# Altium schematic sheet Enable_Pulse_fire.SchDoc
size A3
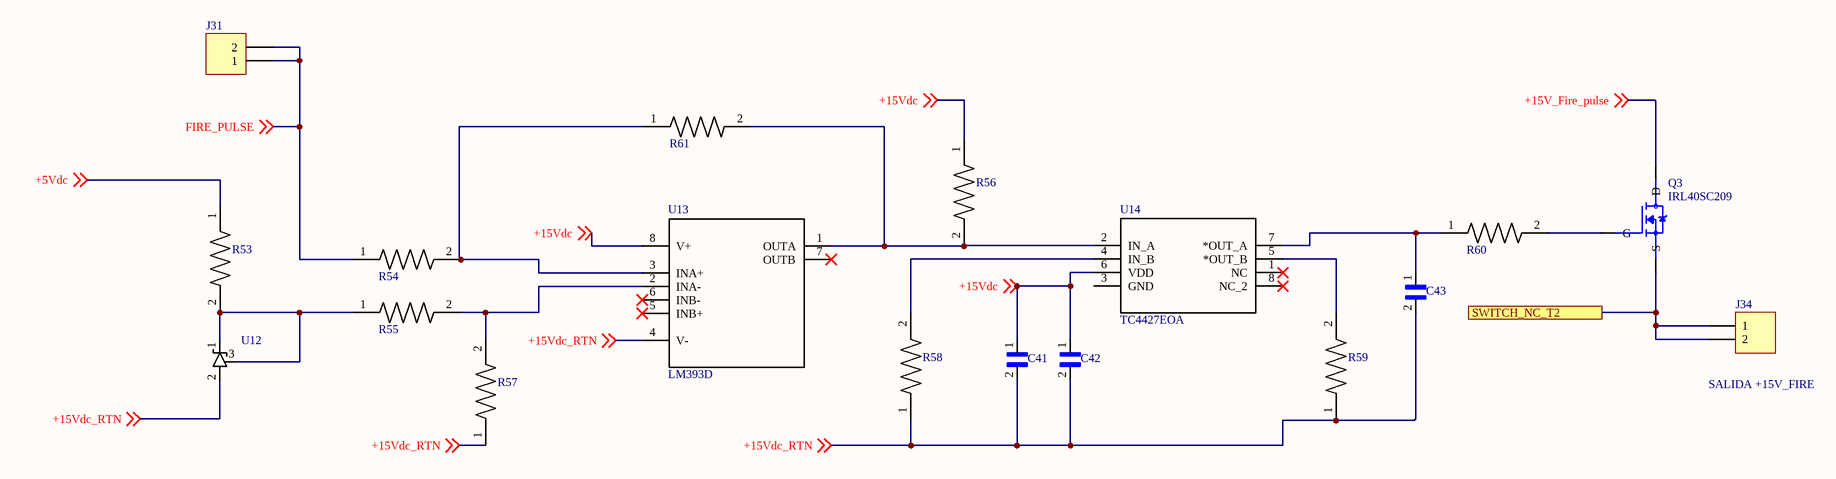
[diagram p0: Enable_Pulse_fire.SchDoc]

## Parts
C41  UMK316AC7475KLHTE  [MLCC SMD 1206]  (value not drawn)
C42  UMF316B7105KLHT  [MLCC SMD 1206]  (value not drawn)
C43  UMF316B7103MFHT  [MLCC SMD 1206]  (value not drawn)
J31  Header 2  [HDR1X2]  (value not drawn)
J34  Header 2  [HDR1X2]  (value not drawn)
Q3  IRL40SC209  [D2PAK-7]
R53  RCG12061K00FKEA  [Vishay Resistor 1206]  (value not drawn)
R54  RCG12061K00FKEA  [Vishay Resistor 1206]  (value not drawn)
R55  RCG12061K00FKEA  [Vishay Resistor 1206]  (value not drawn)
R56  RCG12061K00FKEA  [Vishay Resistor 1206]  (value not drawn)
R57  CRCW12064K02FKEAC  [Vishay Resistor 1206]  (value not drawn)
R58  CRCW12060000Z0EAC  [Vishay Resistor 1206]  (value not drawn)
R59  CRCW12060000Z0EAC  [Vishay Resistor 1206]  (value not drawn)
R60  CRCW12064R70FKEAC  [Vishay Resistor 1206]  (value not drawn)
R61  CRCW1206121KFKEA  [Vishay Resistor 1206]  (value not drawn)
U12  LM431BIM3/NOPB  [LM431BIM3/NOPB]  (value not drawn)
U13  LM393D  [SOIC-8]
U14  TC4427EOA  [TC4427EOA]

## Ports
SWITCH_NC_T2

## Nets
+5Vdc: R53.1 ; off-sheet +5Vdc
+15V_Fire_pulse: Q3.D ; off-sheet +15V_Fire_pulse
+15Vdc: C41.1 C42.1 R56.1 U13.8(V+) U14.6(VDD) ; off-sheet +15Vdc
+15Vdc_RTN: C41.2 C42.2 C43.2 R57.1 R58.1 R59.1 U12.2 U13.4(V-) ; off-sheet +15Vdc_RTN
FIRE_PULSE: J31.1 J31.2 R54.1 ; off-sheet FIRE_PULSE
SWITCH_NC_T2: J34.1 J34.2 Q3.S ; port SWITCH_NC_T2
NetC43_1: C43.1 R60.1 U14.7(*OUT_A)
NetQ3_G: Q3.G R60.2
NetR53_2: R53.2 R55.1 U12.1 U12.3
NetR54_2: R54.2 R61.1 U13.3(INA+)
NetR55_2: R55.2 R57.2 U13.2(INA-)
NetR56_2: R56.2 R61.2 U13.1(OUTA) U14.2(IN_A)
NetR58_2: R58.2 U14.4(IN_B)
NetR59_2: R59.2 U14.5(*OUT_B)

Not connected (* = marked no-connect by the designer): U13 5(INB+)* 6(INB-)* 7(OUTB)*; U14 1(NC)* 3(GND) 8(NC_2)*

## Notes on the sheet
- (near J34) SALIDA +15V_FIRE

## Library data of the parts
C41 = Taiyo Yuden: 1216 50V 4.7uF 10% X7S; ComponentLink1Description: UMK316AC7475KLHTE; ComponentLink1URL: https://www.mouser.es/ProductDetail/Taiyo-Yuden/UMK316AC7475KLHTE?qs=sGAEpiMZZMs0AnBnWHyRQPSjYu%2Fkbgu8BJH7ma7m9%2FAubYLGLnAQNQ%3D%3D
C42 = Taiyo Yuden: 1206 50V 1uF 10%; ComponentLink1Description: UMF316B7105KLHT; ComponentLink1URL: https://www.mouser.es/ProductDetail/Taiyo-Yuden/UMF316B7105KLHT?qs=sGAEpiMZZMs0AnBnWHyRQNStjhAUP4u8IFiqcRtjyKUDsygV%252B%252BauIQ%3D%3D
C43 = Taiyo Yuden: 1206 50V 0.01uF 20%; ComponentLink1Description: UMF316B7103MFHT; ComponentLink1URL: https://www.mouser.es/ProductDetail/Taiyo-Yuden/UMF316B7103MFHT?qs=sGAEpiMZZMs0AnBnWHyRQNStjhAUP4u85ccYWuzgIHbm0bjeY2qbAQ%3D%3D
J31 J34 = Header 2: Header, 2-Pin; LatestRevisionDate: 17-Jul-2002; LatestRevisionNote: Re-released for DXP Platform.; Publisher: Altium Limited
Q3 = IRL40SC209: MOSFET TRENCH <= 40V; ComponentLink1Description: Datasheet; ComponentLink1URL: https://www.mouser.es/datasheet/2/196/Infineon-IRL40SC209-DS-v02_02-EN-1732032.pdf; ComponentLink2Description: https://www.mouser.es/ProductDetail/Infineon-Technologies/IRL40SC209?qs=%252BdQmOuGyFcGGt2Q5zMahtw==; ComponentLink2URL: IRL40SC209
R53-R56 = Vishay: 1K; ComponentLink1Description: RCG12061K00FKEA; ComponentLink1URL: https://www.mouser.es/ProductDetail/Vishay-Draloric/RCG12061K00FKEA?qs=sGAEpiMZZMvdGkrng054t%2FOb%2F3W47a3IfG8pBRzhcNk%3D
R57 = Vishay: 4K; ComponentLink1Description: CRCW12064K02FKEAC; ComponentLink1URL: https://www.mouser.es/ProductDetail/Vishay-Dale/CRCW12064K02FKEAC?qs=sGAEpiMZZMvdGkrng054t0DrEhLhGh8g4Tnz4k1T80cWvTBGCv6WCg%3D%3D
R58 R59 = Vishay: 0OHM; ComponentLink1Description: CRCW12060000Z0EAC; ComponentLink1URL: https://www.mouser.es/ProductDetail/Vishay-Dale/CRCW12060000Z0EAC?qs=sGAEpiMZZMvdGkrng054t0DrEhLhGh8gmWu5YO3o1qhRpAhriXClmA%3D%3D
R60 = Vishay: 4.7OHM; ComponentLink1Description: CRCW12064R70FKEAC; ComponentLink1URL: https://www.mouser.es/ProductDetail/Vishay-Dale/CRCW12064R70FKEAC?qs=sGAEpiMZZMvdGkrng054t0DrEhLhGh8g7se0aMUU2GFN560coxHGKA%3D%3D
R61 = Vishay: 121K; ComponentLink1Description: CRCW1206121KFKEA; ComponentLink1URL: https://www.mouser.es/ProductDetail/Vishay-Dale/CRCW1206121KFKEA?qs=sGAEpiMZZMukHu%252BjC5l7YbqP04GeSeqX%252BpAfvKVU%2F%2F0%3D
U12 = LM431BIM3/NOPB: Referencias de voltaje ADJ PREC ZENER SHUNT REG; ComponentLink1Description: Datasheets; ComponentLink1URL: http://www.ti.com/lit/ds/symlink/lm431.pdf; ComponentLink2Description: LM431BIM3/NOPB; ComponentLink2URL: https://www.mouser.es/ProductDetail/Texas-Instruments/LM431BIM3-NOPB?qs=sGAEpiMZZMuBck1X%252B7j9fFxOFMTVQaIHvc6TlFQ3VqM%3D
U14 = TC4427EOA: Controlador de puerta 1.5A Dual MOSFET Dr NonInver Etemp SOIC8
U13 = LM393D: ComponentLink1Description: Datasheet; ComponentLink1URL: http://www.ti.com/lit/ds/symlink/lm393.pdf?ts=1588059857251; ComponentLink2Description: LM393DR; ComponentLink2URL: https://www.mouser.es/ProductDetail/Texas-Instruments/LM393DR?qs=8k%2FZSzWMuCP%2FrtMSX0i7pQ%3D%3D